# Altium schematic sheet SHT.SchDoc
size A
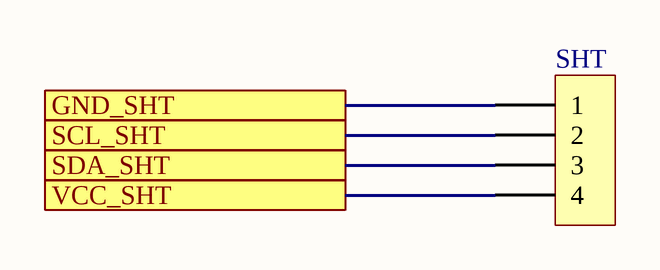
[diagram p0: SHT.SchDoc]

## Parts
SHT  Header 4P 2.54 Duc Thang  [XH2.54M-4]  (value not drawn)

## Ports
GND_SHT, SCL_SHT, SDA_SHT, VCC_SHT

## Nets
GND_SHT: SHT.1 ; port GND_SHT
SCL_SHT: SHT.2 ; port SCL_SHT
SDA_SHT: SHT.3 ; port SDA_SHT
VCC_SHT: SHT.4 ; port VCC_SHT

## Library data of the parts
SHT = Header 4P 2.54 Duc Thang: Cắm; Ten_Linh_Kien: Header 4P XH2.54-4P Đực Thẳng; Don_Vi: Con; Ma_Hang: MH001285; Chung_Loai: Cắm